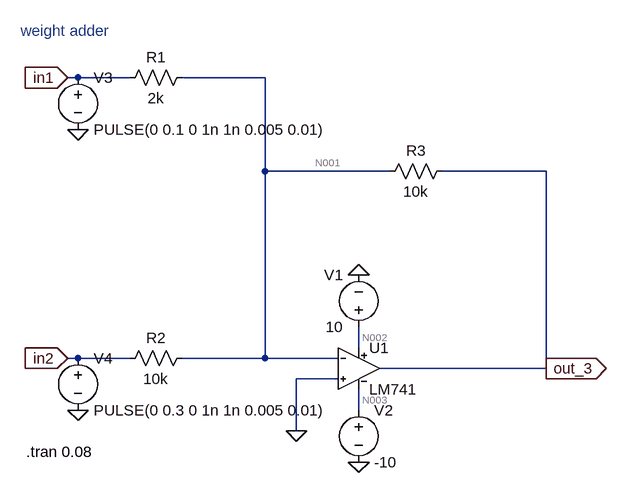
[diagram p0: schematic weight_adder.asc]
weight_adder.asc, the LTspice schematic file:
Version 4
SHEET 1 880 680
WIRE -544 -432 -560 -432
WIRE -464 -432 -544 -432
WIRE -256 -432 -384 -432
WIRE -256 -288 -256 -432
WIRE -64 -288 -256 -288
WIRE 176 -288 16 -288
WIRE -112 -16 -112 -48
WIRE -544 0 -560 0
WIRE -464 0 -544 0
WIRE -256 0 -256 -288
WIRE -256 0 -384 0
WIRE -144 0 -256 0
WIRE 176 16 176 -288
WIRE 176 16 -80 16
WIRE -144 32 -208 32
WIRE -112 80 -112 48
WIRE -208 112 -208 32
FLAG -112 -128 0
FLAG -112 160 0
FLAG -208 112 0
FLAG -560 -432 in1
IOPIN -560 -432 In
FLAG -560 0 in2
IOPIN -560 0 In
FLAG 176 16 out_3
IOPIN 176 16 Out
FLAG -544 -352 0
FLAG -544 80 0
SYMBOL voltage -112 -32 R180
WINDOW 0 24 96 Left 2
WINDOW 3 24 16 Left 2
WINDOW 123 0 0 Left 2
WINDOW 39 0 0 Left 2
SYMATTR InstName V1
SYMATTR Value 10
SYMBOL voltage -112 64 R0
WINDOW 123 0 0 Left 2
WINDOW 39 0 0 Left 2
SYMATTR InstName V2
SYMATTR Value -10
SYMBOL res -480 -416 R270
WINDOW 0 32 56 VTop 2
WINDOW 3 0 56 VBottom 2
SYMATTR InstName R1
SYMATTR Value 2k
SYMBOL res -480 16 R270
WINDOW 0 32 56 VTop 2
WINDOW 3 0 56 VBottom 2
SYMATTR InstName R2
SYMATTR Value 10k
SYMBOL res -80 -272 R270
WINDOW 0 32 56 VTop 2
WINDOW 3 0 56 VBottom 2
SYMATTR InstName R3
SYMATTR Value 10k
SYMBOL voltage -544 -448 R0
WINDOW 123 0 0 Left 2
WINDOW 39 0 0 Left 2
SYMATTR InstName V3
SYMATTR Value PULSE(0 0.1 0 1n 1n 0.005 0.01)
SYMBOL voltage -544 -16 R0
WINDOW 123 0 0 Left 2
WINDOW 39 0 0 Left 2
SYMATTR InstName V4
SYMATTR Value PULSE(0 0.3 0 1n 1n 0.005 0.01)
SYMBOL LM741 -112 -48 R0
SYMATTR InstName U1
TEXT -632 -504 Left 2 ;weight adder
TEXT -624 144 Left 2 !.tran 0.08

The netlist it stands for:
* weight_adder.asc
V1 N002 0 10
V2 N003 0 -10
R1 in1 N001 2k
R2 in2 N001 10k
R3 N001 out_3 10k
V3 in1 0 PULSE(0 0.1 0 1n 1n 0.005 0.01)
V4 in2 0 PULSE(0 0.3 0 1n 1n 0.005 0.01)
XU1 0 N001 N002 N003 out_3 LM741  ; pins In+ In- V+ V- OUT
* weight adder
.tran 0.08
.lib LM741.lib
.backanno
.end

* Results of the author's LTspice run, read from the files saved beside the schematic
* Operating Point, zero values left out:
*   V(n002) = 10 V
*   V(n003) = -10 V
*   V(n001) = 1 mV
*   V(out_3) = 8.018 mV
*   I(R3) = -701.8 nA
*   I(R2) = -100 nA
*   I(R1) = -500 nA
*   I(V4) = 100 nA
*   I(V3) = 500 nA
*   I(V2) = 1.576 mA
*   I(V1) = -1.576 mA
*   Ix(u1:1) = 57.86 nA
*   Ix(u1:2) = 101.9 nA
*   Ix(u1:99) = 1.576 mA
*   Ix(u1:50) = -1.576 mA
*   Ix(u1:28) = -701.8 nA
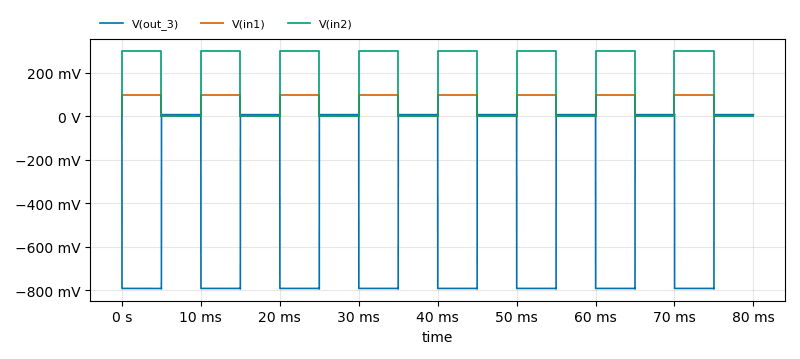
[diagram p1: Transient Analysis of weight_adder.asc, plotted from the saved traces]
* Transient Analysis, 1 run:
*   V(out_3): min -793.9 mV, max 10.07 mV, average -392 mV, rms 559.9 mV, last 8.018 mV
*   V(in1): min 0 V, max 100 mV, average 50 mV, rms 70.71 mV, last 0 V
*   V(in2): min 0 V, max 300 mV, average 150 mV, rms 212.1 mV, last 0 V